# EAGLE design led_driver_3A (EAGLE 6.4)
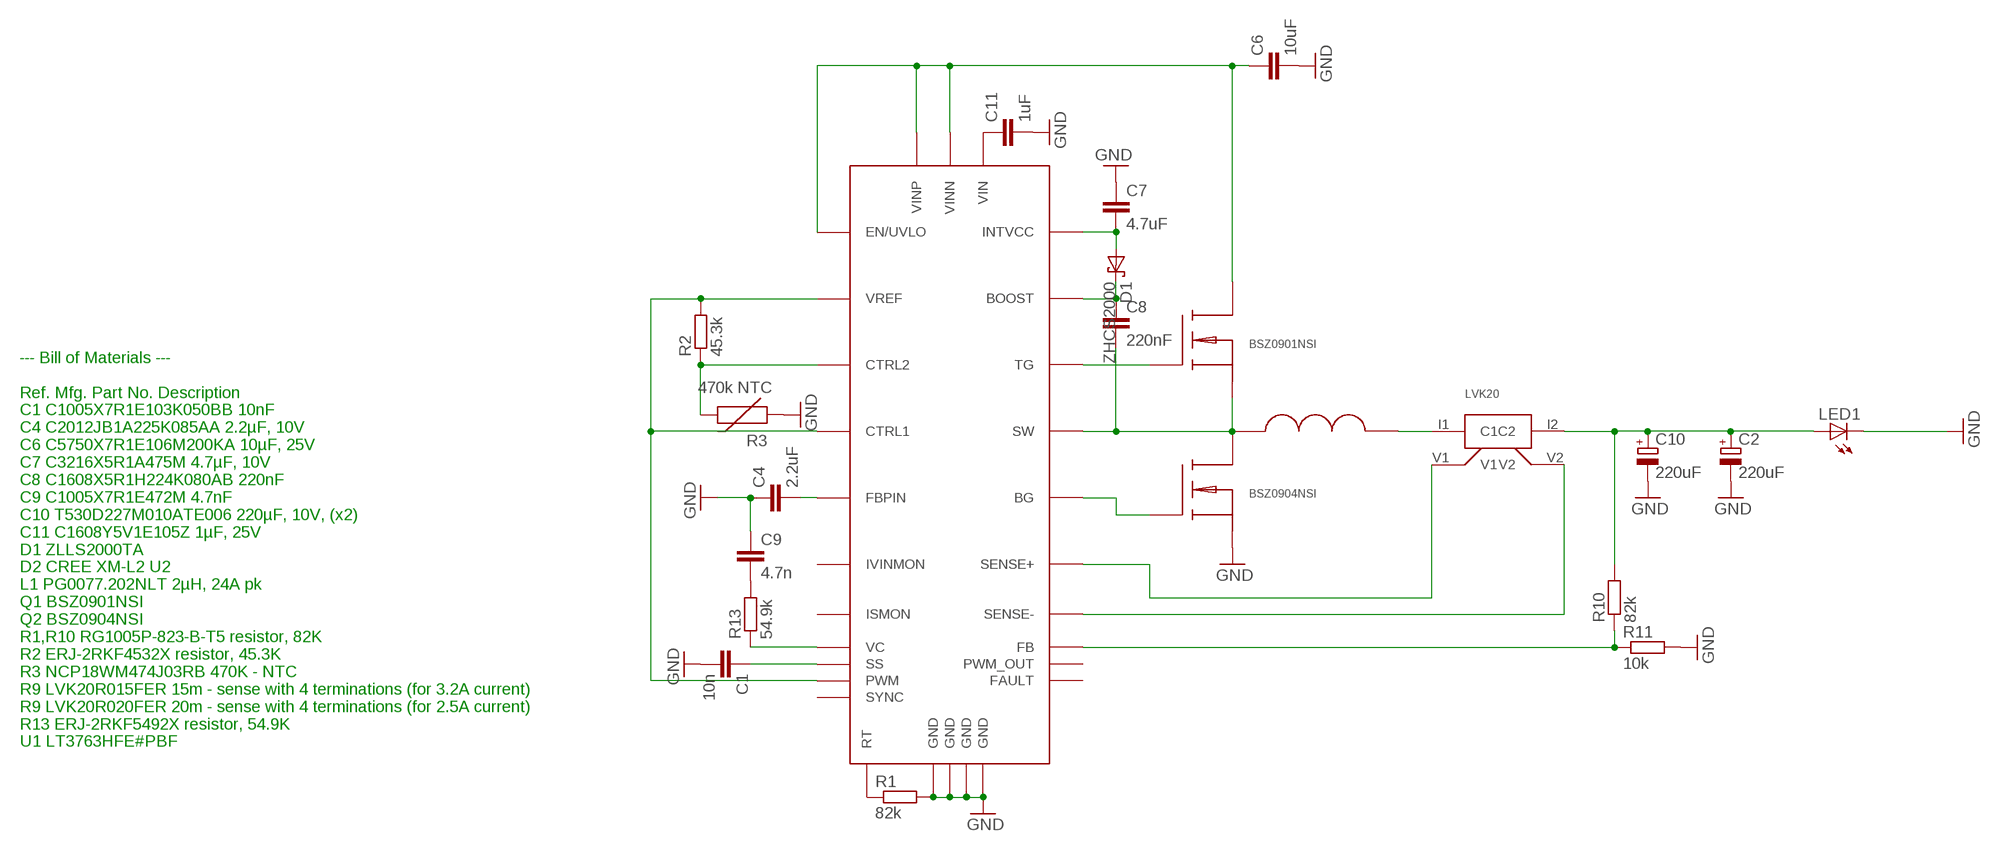
[diagram p0: schematic, sheet 1]

## Parts
C1  10n  C-EUC0402  [C0402]
C2  220uF  CPOL-EUSMCD  [SMC_D]
C4  2.2uF  C-EUC0805  [C0805]
C6  10uF  C-EUC2220K  [C2220K]
C7  4.7uF  C-EUC1206  [C1206]
C8  220nF  C-EUC0603  [C0603]
C9  4.7n  C-EUC0402  [C0402]
C10  220uF  CPOL-EUSMCD  [SMC_D]
C11  1uF  C-EUC0603  [C0603]
D1  ZHCS2000  [SOT23-6]
LED1  LEDSIDELED  [OSRAM-SIDELED]
R1  82k  R-EU_R0402  [R0402]
R2  45.3k  R-EU_R0402  [R0402]
R3  470k NTC  PTC0603  [0603]
R10  82k  R-EU_R0402  [R0402]
R11  10k  R-EU_R0402  [R0402]
R13  54.9k  R-EU_R0402  [R0402]
U$1  LT3763  [TSSOP-28]
U$2  PG0077  [PG0077]
U$3  BSZ0901NSI  BSZ090X  [BSZ090X]
U$4  BSZ0904NSI  BSZ090X  [BSZ090X]
U$5  LVK20  [LVK20]

## Nets
GND: C1.2 C2.- C4.1 C6.2 C7.1 C9.1 C10.- C11.2 LED1.C R1.2 R3.1 R11.2 U$1.P$12(GND) U$1.P$23(GND) U$1.P$28(GND) U$1.TH(GND) U$4.S@1(S) U$4.S@2(S) U$4.S@3(S) U$4.S@4(S)
N$1: C11.1 U$1.P$3(VIN)
N$2: C7.2 D1.3(A) D1.4(A) U$1.P$2(INTVCC)
N$3: C9.2 R13.2
N$4: R2.1 R3.2 U$1.P$13(CTRL2)
N$5 [HI_PWR]: C2.+ C10.+ LED1.A R10.2 U$5.I2(C2)
N$6: R1.1 U$1.P$20(RT)
N$7: R10.1 R11.1 U$1.P$11(FB)
N$8: C1.1 U$1.P$15(SS)
N$9: R13.1 U$1.P$18(VC)
N$10: C4.2 U$1.P$10(FBPIN)
N$11: R2.2 U$1.P$5(VREF) U$1.P$14(CTRL1) U$1.P$22(PWM)
N$12: C8.1 D1.1(K) D1.2(K) D1.5(K) D1.6(K) U$1.P$27(BOOST)
N$13 [AVG_PWR]: C8.2 U$1.P$26(SW) U$2.P$1 U$3.S@1(S) U$3.S@2(S) U$3.S@3(S) U$3.S@4(S) U$4.D U$4.D@1(D) U$4.D@2(D) U$4.D@3(D) U$4.D@4(D)
N$15 [AVG_PWR]: U$1.P$25(TG) U$3.G
N$16 [AVG_PWR]: U$1.P$1(BG) U$4.G
N$17: U$1.P$17(SENSE+) U$5.V1
N$18: U$1.P$16(SENSE-) U$5.V2
N$19: U$2.P$2 U$5.I1(C1)
VIN: C6.1 U$1.P$4(EN/UVLO) U$1.P$6(VINN) U$1.P$7(VINP) U$3.D U$3.D@1(D) U$3.D@2(D) U$3.D@3(D) U$3.D@4(D)
Unconnected: U$1.P$8(IVINMON) U$1.P$9(FAULT) U$1.P$19(ISMON) U$1.P$21(SYNC) U$1.P$24(PWM_OUT)

## Notes on the sheet
- --- Bill of Materials ---
  
  Ref.	Mfg.	Part No.	Description
  C1	C1005X7R1E103K050BB	10nF
  C4	C2012JB1A225K085AA	2.2µF, 10V
  C6	C5750X7R1E106M200KA	10µF, 25V
  C7	C3216X5R1A475M	4.7µF, 10V
  C8	C1608X5R1H224K080AB	220nF
  C9	C1005X7R1E472M	4.7nF
  C10	T530D227M010ATE006	220µF, 10V, (x2)
  C11	C1608Y5V1E105Z	1µF, 25V
  D1	ZLLS2000TA
  D2	CREE XM-L2 U2
  L1	PG0077.202NLT 2µH, 24A pk
  Q1	BSZ0901NSI
  Q2	BSZ0904NSI
  R1,R10	RG1005P-823-B-T5	resistor, 82K
  R2	ERJ-2RKF4532X	resistor, 45.3K
  R3	NCP18WM474J03RB 470K - NTC
  R9	LVK20R015FER 15m - sense with 4 terminations (for 3.2A current)
  R9	LVK20R020FER 20m - sense with 4 terminations (for 2.5A current)
  R13	ERJ-2RKF5492X	resistor, 54.9K
  U1	LT3763HFE#PBF

## Library data of the parts
C1 C4 C6-C9 C11 = resistor:C-EU: CAPACITOR, European symbol
C2 C10 = resistor:CPOL-EU: POLARIZED CAPACITOR, European symbol
D1 = zetex:ZHCS2000: SHOTTKY DIODE; MPN: ZHCS2000; OC_FARNELL: 9525653; OC_NEWARK: 98K3992
LED1 = led:LED: LED OSRAM: - CHIPLED LG R971, LG N971, LY N971, LG Q971, LY Q971, LO R971, LY R971 LH N974, LH R974 LS Q976, LO Q976, LY Q976 LO Q996 - Hyper CHIPLED LW Q18S LB Q993, LB Q99A, LB R99A - SideLED LS A670, LO A670, LY A670, LG A670, LP A670 LB A673, LV A673, LT A673, LW A673 LH A674 LY A675 LS A676, LA A676, LO A676, LY A676, LW A676 LS A679, LY A679, LG A679 - Hyper Micro SIDELED® LS Y876, LA Y876, LO Y876, LY Y876 LT Y87S - SmartLED LW L88C, LW L88S LB L89C, LB L89S, LG L890 LS L89K, LO L89K, LY L89K LS L896, LA L896, LO L896, LY L896 - TOPLED LS T670, LO T670, LY T670, LG T670, LP T670 LSG T670, LSP T670, LSY T670, LOP T670, LYG T670 LG T671, LOG T671, LSG T671 LB T673, LV T673, LT T673, LW T673 LH T674 LS T676, LA T676, LO T676, LY T676, LB T676, LH T676, LSB T676, LW T676 LB T67C, LV T67C, LT T67C, LS T67K, LO T67K, LY T67K, LW E67C LS E67B, LA E67B, LO E67B, LY E67B, LB E67C, LV E67C, LT E67C LW T67C LS T679, LY T679, LG T679 LS T770, LO T770, LY T770, LG T770, LP T770 LB T773, LV T773, LT T773, LW T773 LH T774 LS E675, LA E675, LY E675, LS T675 LS T776, LA T776, LO T776, LY T776, LB T776 LHGB T686 LT T68C, LB T68C - Hyper Mini TOPLED® LB M676 - Mini TOPLED Santana® LG M470 LS M47K, LO M47K, LY M47K Source: http://www.osram.convergy.de LUXEON: - LUMILED® LXK2-PW12-R00, LXK2-PW12-S00, LXK2-PW14-U00, LXK2-PW14-V00 LXK2-PM12-R00, LXK2-PM12-S00, LXK2-PM14-U00 LXK2-PE12-Q00, LXK2-PE12-R00, LXK2-PE12-S00, LXK2-PE14-T00, LXK2-PE14-U00 LXK2-PB12-K00, LXK2-PB12-L00, LXK2-PB12-M00, LXK2-PB14-N00, LXK2-PB14-P00, LXK2-PB14-Q00 LXK2-PR12-L00, LXK2-PR12-M00, LXK2-PR14-Q00, LXK2-PR14-R00 LXK2-PD12-Q00, LXK2-PD12-R00, LXK2-PD12-S00 LXK2-PH12-R00, LXK2-PH12-S00 LXK2-PL12-P00, LXK2-PL12-Q00, LXK2-PL12-R00 Source: www.luxeon.com KINGBRIGHT: KA-3528ASYC Source: www.kingbright.com
R1 R2 R10 R11 R13 = resistor:R-EU_: RESISTOR, European symbol
R3 = SparkFun-PowerIC:PTC: Resettable Fuse PTC Resettable Fuse. Spark Fun Electronics SKU : COM-08357
U$1 = vsd_custom:LT3763
U$2 = vsd_custom:PG0077
U$3 U$4 = vsd_custom:BSZ090X
U$5 = vsd_custom:LVK20

## Net classes
1 AVG_PWR: width 0.381 mm
2 HI_PWR: width 0.457 mm

## Board
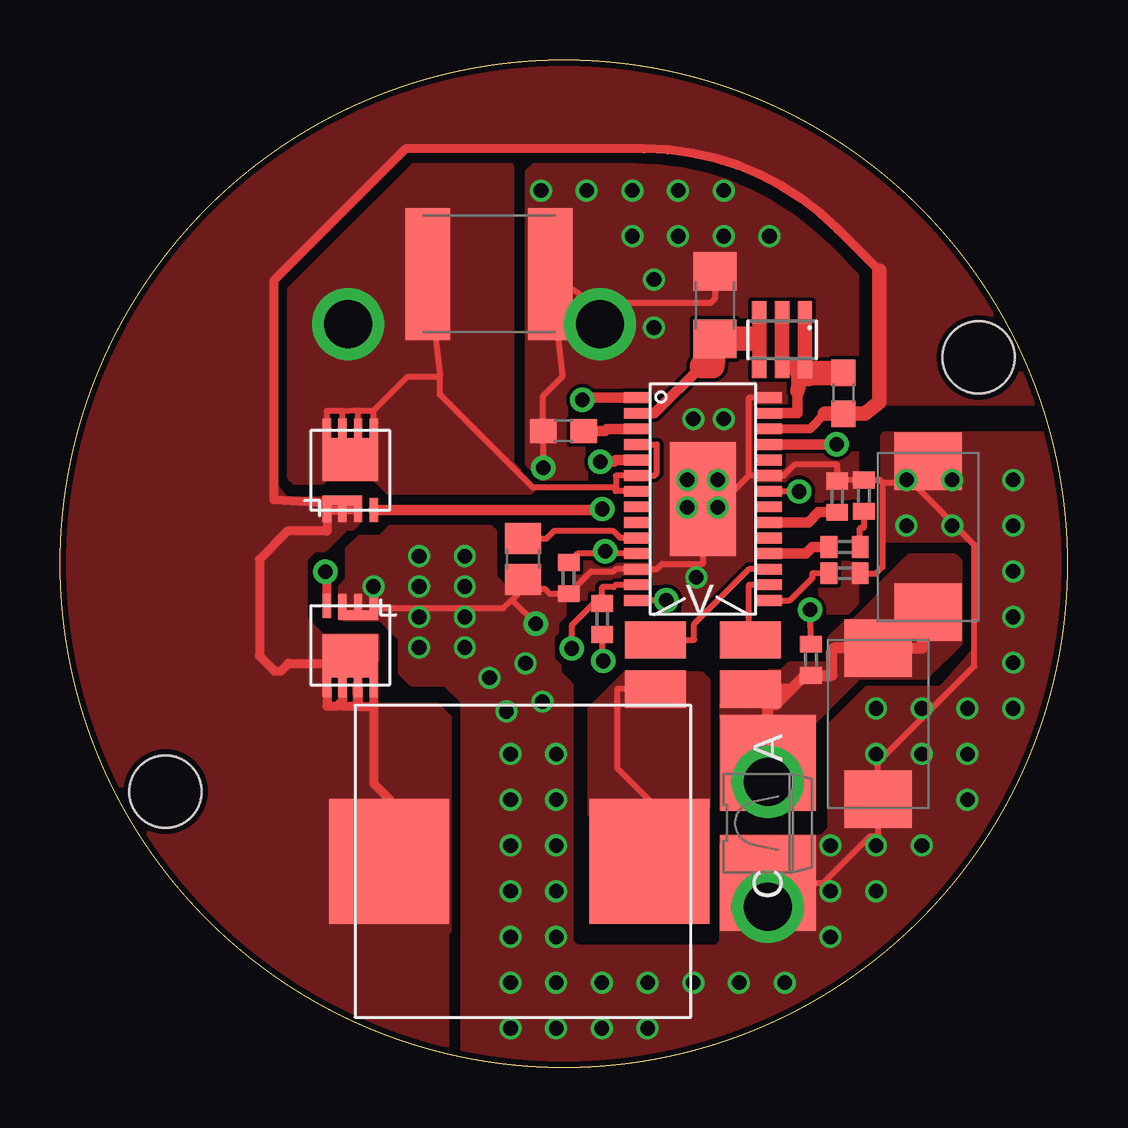
[diagram p1: board, top side]
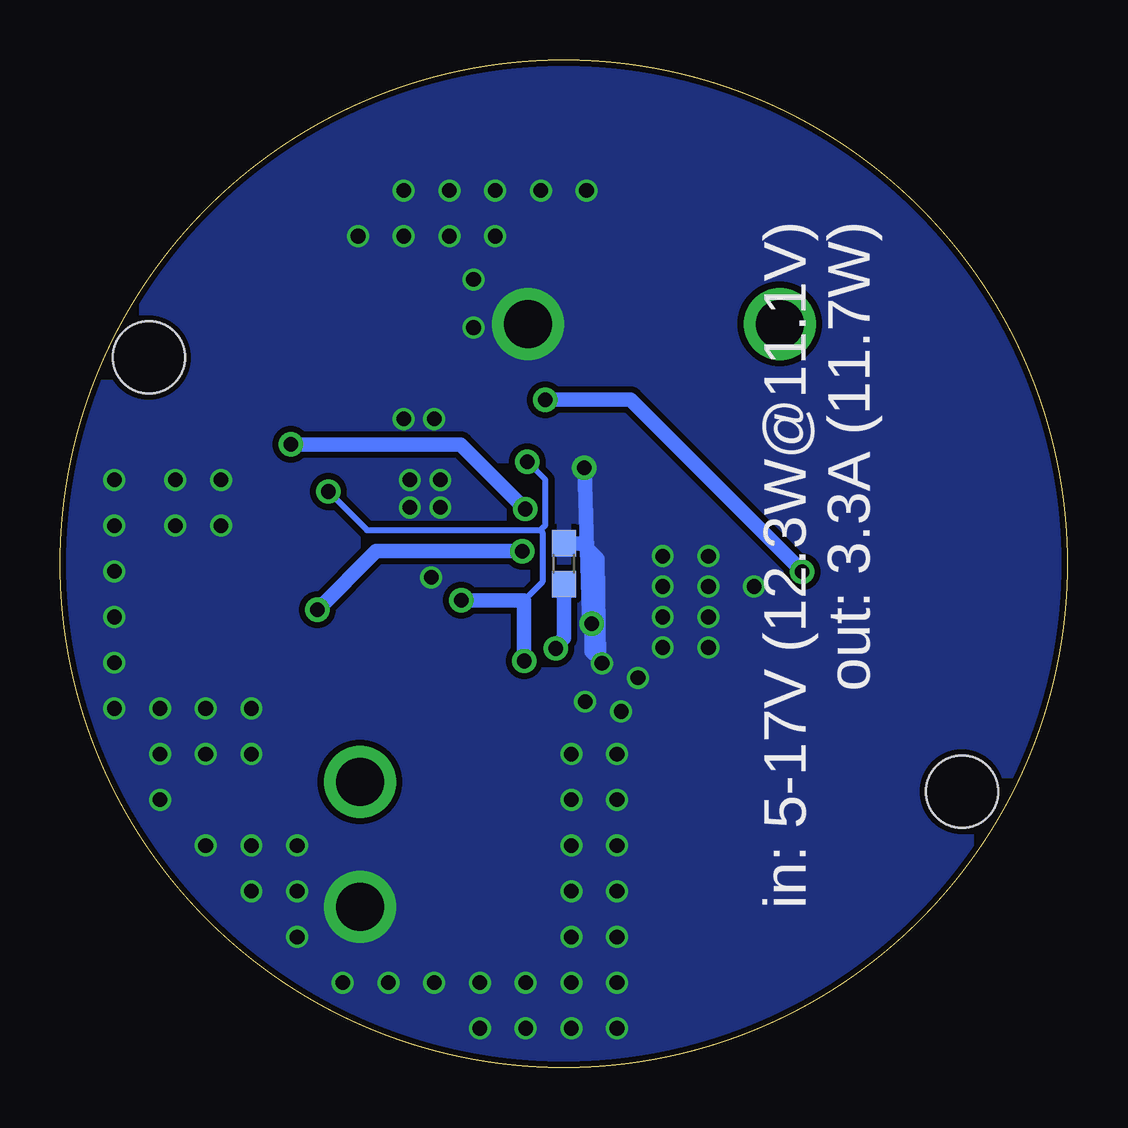
[diagram p2: board, bottom side, seen from below]

Size 42 x 42 mm. Coordinates in mm from the lower left corner, seen from the top.
Outline: circle at 21,21 radius 21
Copper layers (1*16): Top 0.035mm / dielectric 1.5mm / Bottom 0.035mm
Design rules "Fusion_eagle_rule_v1.1": minimum track width 6mil, minimum drill 12mil, track to track 6mil, track to pad 6mil, pad to pad 6mil, via to via 6mil, smd to smd 0mil, copper to edge 10mil, drill to drill 10mil, minimum pad ring 10mil, minimum via ring 6mil, stop-mask expansion 2mil, vias tented up to drill 100mil, thermal gap 10mil
Holes 3 mm at 4.4,11.5 38.3,29.6

### Footprints (pad centres in the part's own frame; a part is rotated, then mirrored left to right if it is on the bottom)
C0402 = smd 0.7 x 0.9: 1 -0.65,0; 2 0.65,0
SMC_D = smd 2.4 x 2.8: + -3.15,0; - 3.15,0
C0805 = smd 1.3 x 1.5: 1 -0.85,0; 2 0.85,0
C2220K = smd 1.85 x 5.5: 1 -2.55,0; 2 2.55,0
C1206 = smd 1.6 x 1.8: 1 -1.4,0; 2 1.4,0
C0603 = smd 1.1 x 1: 1 -0.85,0; 2 0.85,0
SOT23-6 = smd 0.6 x 0.9: 1 -0.95,-1.15; 2 0,-1.15; 3 0.95,-1.15; 4 0.95,1.15; 5 0,1.15; 6 -0.95,1.15
OSRAM-SIDELED = smd 4 x 4: A 0,2.5; C 0,-2.5
R0402 = smd 0.7 x 0.9: 1 -0.65,0; 2 0.65,0
0603 = smd 1.1 x 1: 1 -0.85,0; 2 0.85,0
TSSOP-28 = smd 1.05 x 0.45: P$1 -2.775,4.225; P$2 -2.775,3.575; P$3 -2.775,2.925; P$4 -2.775,2.275; P$5 -2.775,1.625; P$6 -2.775,0.975; P$7 -2.775,0.325; P$8 -2.775,-0.325; P$9 -2.775,-0.975; P$10 -2.775,-1.625; P$11 -2.775,-2.275; P$12 -2.775,-2.925; P$13 -2.775,-3.575; P$14 -2.775,-4.225; P$15 2.775,-4.225; P$16 2.775,-3.575; P$17 2.775,-2.925; P$18 2.775,-2.275; P$19 2.775,-1.625; P$20 2.775,-0.975; P$21 2.775,-0.325; P$22 2.775,0.325; P$23 2.775,0.975; P$24 2.775,1.625; P$25 2.775,2.275; P$26 2.775,2.925; P$27 2.775,3.575; P$28 2.775,4.225 | smd 2.74 x 4.75: TH 0,0
PG0077 = smd 5 x 5.2: P$1 -5.575,0; P$2 5.275,0
BSZ090X = smd 1.8 x 2.3: D 0.44,0 | smd 1 x 0.35: D@1 1.65,-0.975; D@2 1.65,-0.325; D@3 1.65,0.325; D@4 1.65,0.975; G -1.65,-0.975; S@2 -1.65,-0.325; S@3 -1.65,0.325; S@4 -1.65,0.975 | smd 0.4 x 1.65: S@1 -1.25,0.325
LVK20 = smd 2.55 x 1.55: I1 -1.975,-1.025; I2 1.975,-1.025; V1 -1.975,1.025; V2 1.975,1.025

### Placement (x,y rotation side)
C1  32.7,20.6 0 top
C2  34.1,14.33 270 top
C4  19.3,21.2 90 top
C6  17.89,33.08 0 top
C7  27.3,31.78 270 top
C8  32.65,28.11 270 top
C9  33.51,23.84 270 top
C10  36.19,22.12 90 top
C11  20.99,26.54 180 top
D1  30.1,30.34 180 top
LED1  29.5,10.19 0 top
R1  32.4,23.8 90 top
R2  22.6,18.7 270 top
R3  21,21 270 bottom
R10  31.3,17 270 top
R11  21.2,20.4 270 top
R13  32.7,21.7 0 top
U$1  26.8,23.7 0 top
U$2  19.3,8.6 0 top
U$3  12.1,24.9 90 top
U$4  12.1,17.6 270 top
U$5  26.8,16.8 0 top

### Tracks (layer width: path | path; a pad name or v marks a point on that pad's centre or on a via)
GND  (via drill 0.61 pad 0.81, 0.61 pad 1.02, 2, 2 pad 2)
  Top 0.254: 26.8,22.75 28.72,24.68 | U$1.TH 26.8,22.75 | 26.8,22.75 26.8,22.35 26.8,21 25.1,21 24.88,20.77 U$1.P$12 23.6,20.77 23.17,20.77 23.08,20.69 22.14,20.69 R11.2 20.42,19.75 20.21,19.96 19.3,19.96 | v20.14,25.01 C11.2 20.14,28 20.94,28.8 C6.2 22.2,31.88 27.13,31.88 27.3,32.05 C7.1 | 18.84,19.5 | 18.84,19.5 19.3,19.96 | 13.07,19.15 18.49,19.15 18.84,19.5 | v19.83,18.5 18.84,19.5 | 28.72,24.68 28.72,27.93 U$1.P$28 | 35.52,24.38 36.19,25.05 C10.- | 34.29,24.38 35.52,24.38 | 35.52,24.38 38.12,21.78 38.12,16.73 34.1,12.71 C2.- 34.1,10.41 34.1,9.65 33.79,9.65 31.83,7.69 LED1.C | 34.29,24.38 34.29,20.86 34.03,20.6 C1.2 | 34.29,24.38 34.18,24.49 C9.1 32.73,24.49 32.43,24.79 32.4,24.79 | 32.4,24.79 32.4,25.13 30.62,25.13 30.16,24.68 U$1.P$23 28.72,24.68 | R1.2 32.4,24.79 | 13.07,19.15 13.07,18.84 U$4.S@1 | U$4.S@4 13.07,19.15 | U$4.S@1 12.1,18.82 11.78,18.82 U$4.S@2 | U$4.S@3 U$4.S@1 | C4.1 19.3,19.96
  Bottom 0.6: v20.14,25.01 19.94,18.91 v19.83,18.5 19.83,17.35 19.54,17.06 19.6,21.2 20.25,21.85 R3.1
  other vias: 16.88,20.05 14.97,20.05 13.06,20.05 14.97,21.32 16.88,21.32 14.97,18.78 16.88,18.78 16.88,17.51 14.97,17.51 21.95,36.56 23.86,36.56 25.77,36.56 27.67,36.56 23.86,34.66 24.76,32.85 24.76,30.84 25.77,34.66 27.67,34.66 29.57,34.66 39.73,24.5 39.73,22.59 39.73,20.68 39.73,18.78 39.73,16.88 39.73,14.97 37.83,14.97 37.83,13.06 18.78,3.54 20.68,3.54 22.59,3.54 24.5,3.54 26.4,3.54 20.68,1.64 22.59,1.64 18.78,1.64 18.78,5.45 18.78,7.35 18.78,9.26 18.78,11.16 18.78,13.06 20.68,13.06 20.68,11.16 20.68,9.26 20.68,7.35 20.68,5.45 24.5,1.64 28.3,3.54 17.91,16.24 18.61,14.85 32.11,5.45 20.05,36.56 26.4,27.04 27.67,27.04 26.53,20.43 26.15,24.5 27.42,24.5 26.15,23.35 27.42,23.35 32.11,7.35 20.11,15.25 19.41,16.85 34.02,7.35 34.02,9.26 32.11,9.26 35.92,9.26 35.92,14.97 34.02,14.97 34.02,13.06 35.92,13.06 35.29,24.5 37.2,24.5 35.29,22.59 37.2,22.59 37.83,11.16 30.21,3.54 29.5,6.7 22.5,31
  pour Top (no thermals): 34.4,22.1 34.4,26.3 45.4,26.3 49.3,10.2 33.3,-2.3 16.92,-1.1 16.9,2.02 16.9,15.3 16.1,16.1 14.7,16.1 14.3,16.5 14.3,17.9 13.4,18.8 11.9,18.8 11.8,18.9 11.8,20 12.1,20.3 12.1,21.58 12.52,22 13.4,22 13.8,22.4 17.9,22.4 18,22.3 18,20.4 18.7,19.7 20.2,19.7 20.3,19.6 20.6,19.6 20.9,19.3 20.9,18.9 20.6,18.6 20.6,18.2 20.4,18 20.4,17 20.7,16.7 20.7,16.4 21.2,15.9 21.2,5.2 21.5,4.9 27.4,4.9 27.7,5.2 27.7,9.3 27.9,9.5 31.8,9.5 32.2,9.9 32.2,14.21 33.69,15.7 36.8,15.7 38.2,17.3 38.2,21.8 37.9,22.1
  pour Top (no thermals): 19.8,37.5 23.88,37.5 arc-45 31.94,34.16 33.1,33 33.1,19.4 32.8,19.1 22.3,19.1 21.6,19.8 21.6,23.2 19.6,25.2 19.6,37.3
  pour Bottom (isolate 0.254): 20.6,41.6 43,41.6 43,1.6 29.7,1.6 29.7,-0.2 4.2,-0.2 4.2,7.5 0,7.5 0,16.5 -1.1,16.5 -1.1,32.8 2.8,32.8 2.8,39.3 10.1,39.3 10.1,42.6 20.6,42.6
N$1
  Top 0.432: C11.1 22.72,26.54 22.8,26.62 U$1.P$3
N$2
  Top 0.254: D1.4 29.15,29.58
  Top 0.432: U$1.P$2 24.78,27.27 26.75,29.25
  Top 0.6: 29.15,30.38 D1.3 | 29.15,29.58 29.15,30.38 | 29.15,30.38 28.73,30.38
  Top 1.016: 26.75,29.25 27.2,29.25 C7.2 28.73,30.38
N$3
  Top 0.254: C9.2 33.51,22.51 33.38,22.51 33.35,22.48 R13.2
N$4  (via drill 0.61 pad 1.02)
  Top 0.254: 22.6,19.69 21.33,18.42 v21.33,17.47 | 22.6,19.69 22.6,20.03 23.07,20.03 23.17,20.12 U$1.P$13 | R2.1 22.6,19.69
  Bottom 0.6: R3.2 21,17.9 21.1,17.8 21.34,17.36 21.33,17.35 v21.33,17.47
N$5  (via drill 2 pad 2)
  Top 0.457: 30.48,15.78 31.06,16.35 R10.2 32.18,16.35 32.18,17.39 32.27,17.48 C2.+ 35.93,17.48 35.93,18.39 36.19,18.64 C10.+ | LED1.A v29.5,11.9 LED1.A | LED1.A 29.5,15.12 29.83,15.12 30.48,15.78 | U$5.I2 30.48,15.78
  pour Top (no thermals): 27.6,15.1 27.6,14.6 27.8,14.4 31.4,14.4 33.3,16.3 36.1,16.3 37.5,17.7 37.5,21.1 37.3,21.3 35.4,21.3 34.2,20.1 34.2,19.7 33.1,18.6 33,18.6 32.9,18.5 32.7,18.5 32.1,17.9 32.1,16.9 32,16.8 30.4,16.8 30.1,16.5 29.6,16.5 29.1,16 28.5,16
N$6
  Top 0.432: R1.1 31.62,23.15 31.2,22.73 U$1.P$20
N$7  (via drill 0.61 pad 1.02)
  Top 0.254: 22.73,21.43 21.57,21.43 R11.1 | U$1.P$11 22.73,21.43 | 22.73,21.43 v22.73,21.52 | R10.1 31.3,18.33 31.27,18.36 v31.27,19.08
  Bottom 0.6: v22.73,21.52 28.82,21.52 v31.27,19.08
N$8
  Top 0.254: C1.1 31.37,20.6 31.37,20.41 30.43,19.48 U$1.P$15
N$9
  Top 0.432: R13.1 31.37,21.7 31.09,21.43 U$1.P$18
N$10
  Top 0.254: U$1.P$10 23.36,22.07 23.07,22.36 20.59,22.36 20.28,22.05 C4.2
N$11  (via drill 0.61 pad 1.02)
  Top 0.254: R2.2 22.6,17 v22.65,16.95 | v25.28,19.48 U$1.P$14 | U$1.P$22 30.7,24.02 v30.81,24.01
  Top 0.432: v22.52,25.25 23.1,25.25 23.17,25.32 U$1.P$5
  Bottom 0.254: 21.97,22.4 21.77,22.61 21.77,24.5 v22.52,25.25 | v30.81,24.01 29.2,22.4 21.97,22.4 | 21.97,22.4 21.89,22.31 21.89,20.24 22.65,19.48
  Bottom 0.6: v25.28,19.48 22.65,19.48 v22.65,16.95
N$12
  Top 0.254: 30.78,28.53 30.96,29.13 | D1.6 30.75,29.1
  Top 0.432: 30.73,28.19 30.73,27.27 U$1.P$27 | 30.75,29.1 31.19,28.9 | D1.5 30.1,29.21
  Top 0.6: D1.5 30.96,29.13 30.73,28.19 | 30.75,29.1 30.78,28.53 | D1.2 30.1,29.21 31.05,29.21 D1.1
  Top 1.016: 31.19,28.9 31.31,28.96 C8.1
N$13
  Top 0.381: 34.16,33.21 32.43,34.95 arc45 24.34,38.3 14.41,38.3 8.92,32.8 8.92,23.67 11.04,23.55 U$3.S@4 | 11.78,15.3 11.78,15.07 12.4,15.07 | 11.78,15.3 11.53,15.06 11.12,15.06 U$4.D@1 11.12,16.84 9.53,16.84 9.21,16.53 8.94,16.53 8.32,17.16 8.32,21.19 9.49,22.36 11.12,22.36 U$3.S@4 | U$4.D@2 11.78,15.3 | 31.88,27.26 31.25,26.62 U$1.P$26 | U$3.S@2 U$3.S@3 | U$3.S@4 U$3.S@3 | U$2.P$1 13.72,11.19 13.07,11.84 13.07,15.06 | 13.07,15.06 12.43,15.06 U$4.D@3 12.38,15.95 12.4,15.07 | U$4.D@4 13.07,15.06 | U$4.D 12.4,16.7 12.4,15.07 | U$3.S@3 U$3.S@1
  Top 0.61: 34.16,33.21 34.16,27.75 33.54,27.26 C8.2 31.88,27.26
  pour Top (no thermals): 16.1,5.6 16.1,0.8 15.9,0.6 9.5,0.7 -11.45,21.25 22.75,50.05 45.1,27.7 34.2,27.7 34.1,28.3 34.1,33.3 31.7,35.8 30.1,36.9 26.2,38.3 14.6,38.5 8.9,32.8 8.9,24.3 9.4,23.7 12,23.7 12.4,23.3 12.4,22.72 12.18,22.5 11.9,22.5 11,21.6 10.6,21.6 10.2,21.2 10.2,18.7 10.9,18 13.2,18 13.2,17 12.8,16.6 11.4,16.6 11.2,16.4 11.2,15.2 11.3,15.1 15.7,15.1 16.2,14.6 16.2,5.7
N$15  (via drill 0.61 pad 1.02)
  Top 0.381: 22.57,23.25 v22.61,23.28
  Top 0.432: U$3.G 22.57,23.25 | U$1.P$25 32.12,25.98 v32.37,25.97
  Bottom 0.6: v22.61,23.28 25.3,25.97 v32.37,25.97
N$16  (via drill 0.61 pad 1.02)
  Top 0.381: v11.05,20.67 11.13,20.24 11.12,20.14 U$4.G
  Top 0.432: 21.85,27.93 U$1.P$1
  Top 0.6: v21.77,27.84 21.85,27.93
  Bottom 0.6: v21.77,27.84 18.22,27.84 v11.05,20.67
N$17
  Top 0.254: U$1.P$17 28.72,20.77 26.43,18.49 26.43,17.82 U$5.V1
N$18
  Top 0.254: U$1.P$16 28.72,20.12 28.72,17.88 U$5.V2
N$19
  Top 0.254: U$2.P$2 24.57,11.13 23.22,12.49 23.22,15.78 U$5.I1
  pour Top (no thermals): 22.2,10.6 22.2,14.9 23.6,16.3 26.7,16.3 26.9,16.1 26.9,10.9 26.7,10.7 22.3,10.7
VIN  (via drill 2)
  Top 0.254: 23.17,24.17 19.72,24.17 15.84,28.05 15.84,28.8 | 23.17,24.17 23.17,24.02 U$1.P$7 | 23.17,24.17 23.17,24.68 U$1.P$6 24.77,24.68 24.88,24.79 24.88,25.98 U$1.P$4 | 13.07,27.38 14.49,28.8 15.84,28.8 | 12.43,26.57 12.43,27.05 12.45,27.38 13.07,27.38 | C6.1 15.84,28.8 | 12.43,26.57 U$3.D@2 | 12.43,26.57 12.4,25.87 | U$3.D@1 13.07,27.38 | 11.78,27.36 12.4,27.4 12.4,25.87 | 11.78,27.36 11.78,27.38 11.12,27.38 U$3.D@4 | U$3.D@3 11.78,27.36 | U$3.D 12.4,25.87
  other vias: 12,31
  pour Top (no thermals): 11.1,26.1 11.1,24.6 10.9,24.4 9.8,24.4 9.6,24.6 9.6,32.45 14.75,37.6 18.8,37.6 18.8,25.2 19.1,24.9 19.1,24.8 19.7,24.2 19.7,24.1 19.6,24 13.7,24 13.1,24.6 13.1,27.3 13,27.4 11.1,27.4 11,27.3 11,26.2

### Text on the board
bPlace: in: 5-17V (12.3W@11.1V) / out: 3.3A (11.7W)
tStop: LED driver